# EAGLE schematic ShieldTemplate (EAGLE 6.3)
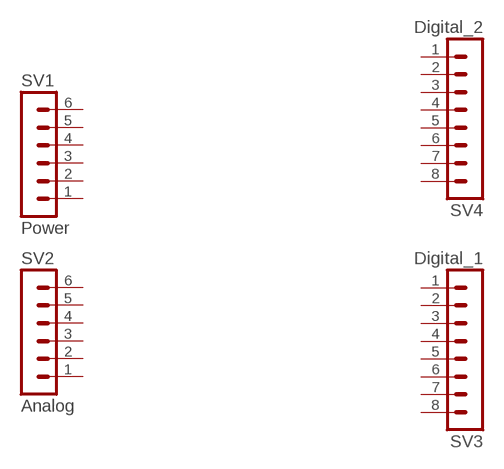
[diagram p0: schematic, sheet 1]

## Parts
SV1  Power  MA06-1  [MA06-1]
SV2  Analog  MA06-1  [MA06-1]
SV3  Digital_1  MA08-1  [MA08-1]
SV4  Digital_2  MA08-1  [MA08-1]
Unconnected: SV1.1 SV1.2 SV1.3 SV1.4 SV1.5 SV1.6 SV2.1 SV2.2 SV2.3 SV2.4 SV2.5 SV2.6 SV3.1 SV3.2 SV3.3 SV3.4 SV3.5 SV3.6 SV3.7 SV3.8 SV4.1 SV4.2 SV4.3 SV4.4 SV4.5 SV4.6 SV4.7 SV4.8

## Library data of the parts
SV1 SV2 = con-lstb:MA06-1: PIN HEADER; OC_FARNELL: unknown; OC_NEWARK: unknown
SV3 SV4 = con-lstb:MA08-1: PIN HEADER; OC_FARNELL: unknown; OC_NEWARK: unknown